# EAGLE design VF_24Euro_PCB (EAGLE 9.6.2)
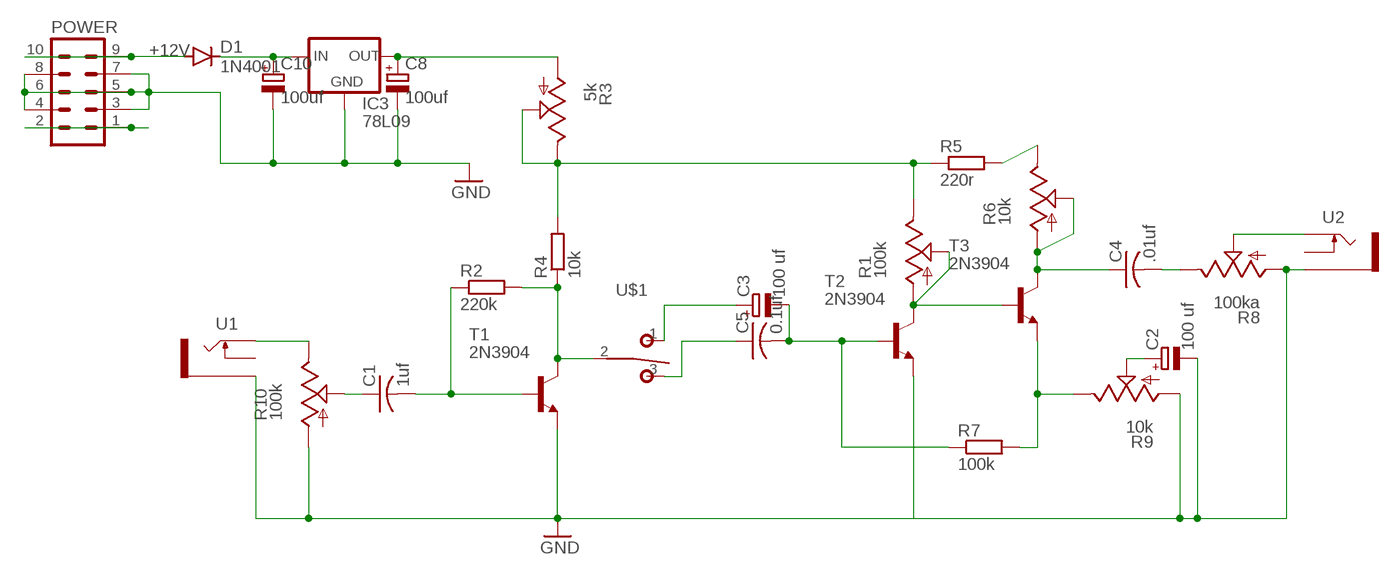
[diagram p0: schematic, sheet 1]

## Parts
C1  1uf  C-US050-025X075  [C050-025X075]
C2  100 uf  CPOL-EUE2.5-7  [E2,5-7]
C3  100 uf  CPOL-EUE2.5-7  [E2,5-7]
C4  .01uf  C-US050-025X075  [C050-025X075]
C5  0.1uf  C-US050-025X075  [C050-025X075]
C8  100uf  CPOL-EUE2.5-7  [E2,5-7]
C10  100uf  CPOL-EUE2.5-7  [E2,5-7]
D1  1N4001  1N4004  [DO41-10]
IC3  78L09  78LXX  [78LXX]
POWER  10_PIN_HEADER  [MA05-2]
R1  100k  9MM_SNAP-IN_POT_  [9MM_SNAP-IN_POT]
R2  220k  RESISTOR7MM  [7MM_RESISTOR]
R3  5k  9MM_SNAP-IN_POT_  [9MM_SNAP-IN_POT]
R4  10k  RESISTOR7MM  [7MM_RESISTOR]
R5  220r  RESISTOR7MM  [7MM_RESISTOR]
R6  10k  9MM_SNAP-IN_POT_  [9MM_SNAP-IN_POT]
R7  100k  RESISTOR7MM  [7MM_RESISTOR]
R8  100ka  9MM_SNAP-IN_POT_  [9MM_SNAP-IN_POT]
R9  10k  9MM_SNAP-IN_POT_  [9MM_SNAP-IN_POT]
R10  100k  9MM_SNAP-IN_POT_  [9MM_SNAP-IN_POT]
T1  2N3904  [TO92]
T2  2N3904  [TO92]
T3  2N3904  [TO92]
U1  THONKICONNNEW  [WQP-PJ301M-12_JACK]
U2  THONKICONNNEW  [WQP-PJ301M-12_JACK]
U$1  T-80-T-SPDT-ON-OFF-ON  [M9040P]

## Nets
+12V [power]: C10.+ D1.C IC3.IN
-12V [power]: POWER.1 POWER.2
GND: C2.- C8.- C10.- IC3.GND POWER.3 POWER.4 POWER.5 POWER.6 POWER.7 POWER.8 R8.1(A) R9.1(A) R10.1(A) T1.3(E) T2.3(E) U1.P$3_SLEEVE(SLEEVE) U2.P$3_SLEEVE(SLEEVE)
N$1: C1.2 R2.1 T1.2(B)
N$2: R2.2 R4.1 T1.1(C) U$1.2(P)
N$3: R1.3(E) R3.2(S) R3.3(E) R4.2 R5.1
N$4: C5.1 U$1.3(S)
N$5: C3.+ U$1.1(O)
N$6: C3.- C5.2 R7.1 T2.2(B)
N$7: R1.1(A) R1.2(S) T2.1(C) T3.2(B)
N$8: R5.2 R6.3(E)
N$9: C4.1 R6.1(A) R6.2(S) T3.1(C)
N$10: C4.2 R8.3(E)
N$11: C2.+ R9.2(S)
N$12: R10.3(E) U1.P$1_TIP(TIP)
N$13: C1.1 R10.2(S)
N$14: R8.2(S) U2.P$1_TIP(TIP)
N$15: D1.A POWER.9 POWER.10
N$16: R7.2 R9.3(E) T3.3(E)
N$26: C8.+ IC3.OUT R3.1(A)
Unconnected: U1.P$2_SWITCH(SWITCH) U2.P$2_SWITCH(SWITCH)

## Library data of the parts
C1 C4 C5 = rcl:C-US: CAPACITOR, American symbol; SPICEPREFIX: C
C2 C3 C8 C10 = rcl:CPOL-EU: POLARIZED CAPACITOR, European symbol; SPICEPREFIX: C
D1 = diode:1N4004: DIODE general purpose rectifier, 1 A
IC3 = v-reg:78LXX: VOLTAGE REGULATOR
POWER = TomW:10_PIN_HEADER: PIN HEADER; OC_FARNELL: unknown; OC_NEWARK: unknown
R1 R3 R6 R8-R10 = MusicThingModular:9MM_SNAP-IN_POT: 9mm vertical snap-in pot, Alpha / Panasonic style
R2 R4 R5 R7 = MusicThingModular:RESISTOR: Standard resistor, various versions
T1-T3 = transistor:2N3904: NPN TRANSISTOR
U1 U2 = MusicThingModular:THONKICONN: 3.5mm socket for Eurorack modular synths
U$1 = MusicThingModular:T-80-T-SPDT-ON-OFF-ON

## Net classes
1 power: width 0.61 mm

## Board
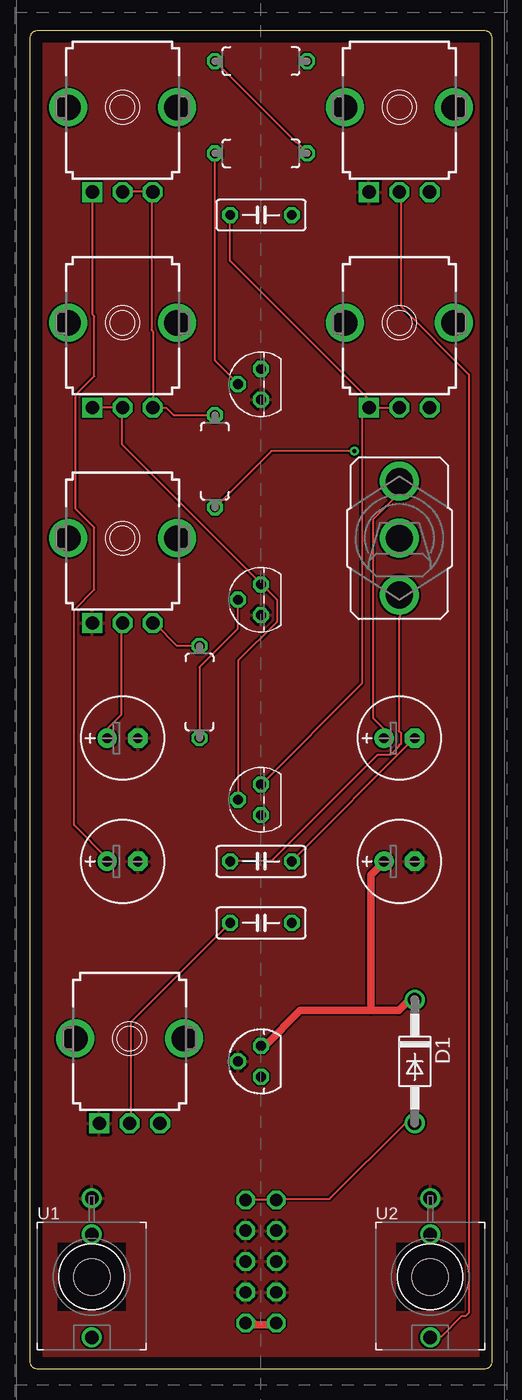
[diagram p1: board, top side]
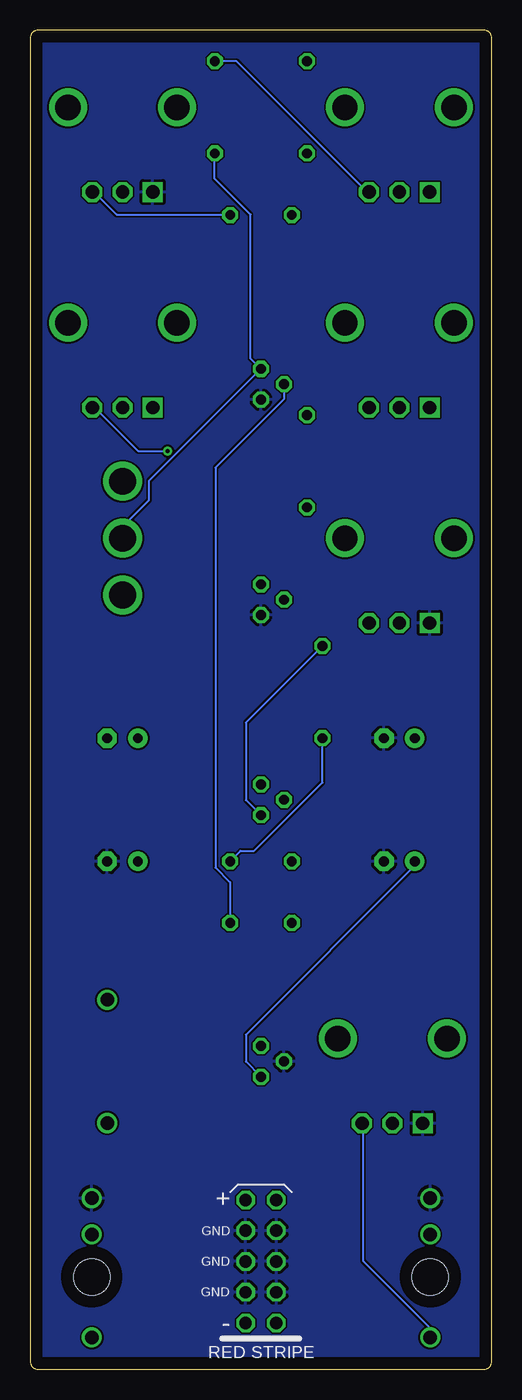
[diagram p2: board, bottom side, seen from below]

Size 38.1 x 110.49 mm. Coordinates in mm from the lower left corner, seen from the top.
Copper layers (1*16): Top 0.035mm / dielectric 1.5mm / Bottom 0.035mm
Design rules "default": minimum track width 6mil, minimum drill 0.35mm, track to track 6mil, track to pad 6mil, pad to pad 6mil, via to via 6mil, smd to smd 6mil, copper to edge 40mil, drill to drill 6mil, minimum pad ring 10mil, minimum via ring 8mil, stop-mask expansion 4mil, vias tented up to drill 0mil, thermal gap 10mil
Holes 3 mm at 33.02,7.62 5.08,7.62

### Footprints (pad centres in the part's own frame; a part is rotated, then mirrored left to right if it is on the bottom)
C050-025X075 = drill 0.813 octagon: 1 -2.54,0; 2 2.54,0
E2,5-7 = drill 0.813 pad 1.6: + -1.27,0 | drill 0.813 pad 1.6 octagon: - 1.27,0
DO41-10 = drill 1.118: A 5.08,0; C -5.08,0
78LXX = drill 0.813 octagon: GND 0,1.905; IN 1.27,0; OUT -1.27,0
MA05-2 = drill 1.016 octagon: 1 -5.08,-1.27; 2 -5.08,1.27; 3 -2.54,-1.27; 4 -2.54,1.27; 5 0,-1.27; 6 0,1.27; 7 2.54,-1.27; 8 2.54,1.27; 9 5.08,-1.27; 10 5.08,1.27
9MM_SNAP-IN_POT = drill 1.1 square: 1 -2.5,-7 | drill 1.1 octagon: 2 0,-7; 3 2.5,-7 | drill 2.1 pad 2.794: CHASSIS1 -4.5,0; CHASSIS2 4.5,0
7MM_RESISTOR = drill 0.813 octagon: 1 -3.81,0; 2 3.81,0
TO92 = drill 0.813 octagon: 1 1.27,0; 2 0,1.905; 3 -1.27,0
WQP-PJ301M-12_JACK = drill 1.1: P$1_TIP 0,5; P$2_SWITCH 0,-3.5; P$3_SLEEVE 0,-6.5
M9040P = drill 2.2: 1 0,4.699 | drill 2.2 pad 3: 2 0,0; 3 0,-4.699

### Placement (x,y rotation side)
C1  19.05,36.83 0 top
C2  7.62,52.07 0 top
C3  30.48,52.07 0 top
C4  19.05,95.25 0 top
C5  19.05,41.91 0 top
C8  7.62,41.91 0 top
C10  30.48,41.91 0 top
D1  31.75,25.4 270 top
IC3  19.05,25.4 90 top
POWER  19.05,8.89 90 bottom
R1  7.62,86.36 0 top
R2  19.05,100.33 0 top
R3  7.62,104.14 0 top
R4  19.05,107.95 0 top
R5  15.24,74.93 270 top
R6  30.48,86.36 0 top
R7  13.97,55.88 90 top
R8  30.48,104.14 0 top
R9  7.62,68.58 0 top
R10  8.2,27.29 0 top
T1  19.05,81.28 90 top
T2  19.05,63.5 90 top
T3  19.05,46.99 90 top
U1  5.08,7.62 180 top
U2  33.02,7.62 180 top
U$1  30.48,68.58 0 top
U$2  [EURO_PCB_8HP]  -1.27,-8.89 0 top  (outside the outline)

### Tracks (layer width: path | path; a pad name or v marks a point on that pad's centre or on a via)
+12V
  Top 0.61: 28.14,29.59 30.43,29.59 31.27,30.43 31.72,30.43 D1.C | 28.14,29.59 22.28,29.59 19.38,26.7 19.07,26.7 IC3.IN | 28.14,29.59 28.14,40.79 29.21,41.86 C10.+
-12V
  Top 0.61: POWER.1 17.78,3.83 18.39,3.83 18.54,3.68 19.68,3.68 19.84,3.83 20.3,3.83 POWER.2
GND
  pour Top: 0,0 38.1,0 38.1,110.49 0,110.49
  pour Bottom: 0,0 38.1,0 38.1,110.49 0,110.49
N$1
  Top 0.152: R2.1 15.27,100.3 15.27,83.24 17.17,81.33 T1.2
  Bottom 0.152: C1.2 21.59,40.18 22.81,41.4 22.81,74.4 17.17,80.03 17.17,81.25 T1.2
N$2
  Top 0.152: R4.1 21.97,101.22 22.05,101.22 22.89,100.38 R2.2
  Bottom 0.152: 19.07,82.55 28.3,73.33 28.3,71.73 30.43,69.6 30.43,68.61 U$1.2 | 19.07,82.55 19.91,83.39 19.91,95.28 22.89,98.25 22.89,100.3 R2.2 | 19.07,82.55 T1.1
N$3
  Top 0.152: R5.1 11.84,78.74 11.23,79.35 10.16,79.35 R1.3 10.16,79.43 10.16,85.6 10.01,85.75 10.01,97.18 | 10.01,97.18 10.08,97.18 R3.3 10.01,97.18 | 10.01,97.18 7.64,97.18 R3.2
  Bottom 0.152: R4.2 22.81,107.92 21.06,107.92 10.31,97.18 10.16,97.18 R3.3
N$4
  Top 0.152: C5.1 16.56,41.94 19.91,41.94 28.68,50.7 29.74,50.7 30.43,51.38 30.43,51.46 30.58,51.61 30.58,52.53 30.43,52.68 30.43,61.98 30.5,62.05 30.5,63.88 U$1.3
N$5
  Top 0.152: C3.+ 29.21,52.83 28.3,53.75 28.3,70.13 30.43,72.26 30.43,73.25 U$1.1
N$6
  Top 0.152: R7.1 13.97,57.94 17.09,61.06 17.09,63.5 T2.2 | C5.2 21.59,41.94 31.72,52.07 C3.-
  Bottom 0.152: R7.1 13.97,48.41 19.61,42.77 20.75,42.77 21.59,41.94 C5.2
N$7
  Top 0.152: R1.1 7.57,79.35 R1.2 7.57,79.27 7.57,76.3 19.07,64.8 | 19.07,64.8 20.37,63.5 20.37,61.67 17.17,58.47 17.17,47.04 T3.2 | 19.07,64.8 T2.1
N$8  (via drill 0.35)
  Top 0.152: v26.77,75.77 19.91,75.77 15.27,71.12 R5.2
  Bottom 0.152: v26.77,75.77 29.21,75.77 32.79,79.35 32.94,79.35 R6.3
N$9
  Top 0.152: T3.1 19.07,48.26 27.38,56.57 27.38,78.82 27.91,79.35 R6.1 | C4.1 16.48,95.2 16.48,91.47 27.91,80.03 27.91,79.43 R6.1 | R6.2 30.43,79.35 R6.1
N$10
  Bottom 0.152: C4.2 21.59,95.28 30.96,95.28 32.79,97.1 32.94,97.1 R8.3
N$11
  Top 0.152: C2.+ 6.35,52.83 7.49,53.98 7.49,61.44 7.57,61.52 R9.2
N$12
  Bottom 0.152: U1.P$1_TIP 5.13,2.69 5.13,3.45 10.62,8.94 10.62,20.14 10.69,20.22 R10.3
N$13
  Top 0.152: C1.1 16.48,36.83 8.33,28.68 8.33,20.37 8.26,20.29 R10.2
N$14
  Top 0.152: U2.P$1_TIP 33.02,2.69 33.93,2.69 35.61,4.37 35.92,4.37 36.22,4.67 36.22,82.09 30.58,87.73 30.58,97.03 30.5,97.1 R8.2
N$15
  Top 0.152: POWER.9 POWER.10 20.37,13.97 20.45,14.05 24.71,14.05 30.96,20.29 31.72,20.29 D1.A
N$16
  Top 0.152: R7.2 12.14,59.69 10.31,61.52 10.16,61.52 R9.3
  Bottom 0.152: T3.3 20.3,46.96 20.3,53.37 R7.2
N$26
  Top 0.152: C8.+ 6.35,42.16 3.61,44.91 3.61,62.66 5.28,64.34 5.28,69.44 3.76,70.97 3.76,80.42 5.28,81.94 5.28,86.89 5.13,87.05 5.13,97.1 R3.1
  Bottom 0.152: C8.+ 6.35,41.55 20.3,27.61 20.3,25.4 19.07,24.18 IC3.OUT